# EAGLE design ESPSwitchBoard (EAGLE 7.3.0)
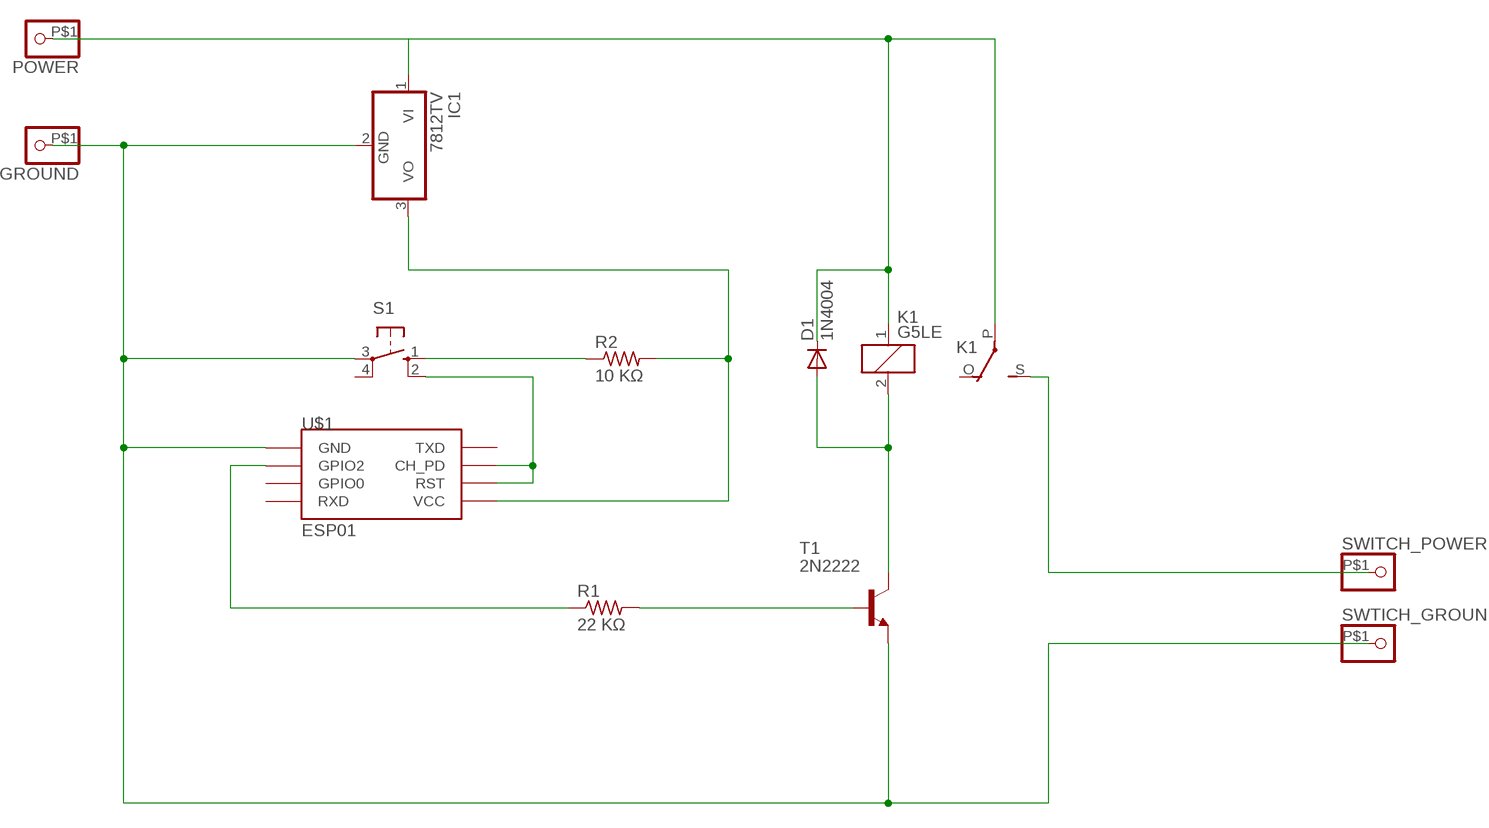
[diagram p0: schematic, sheet 1]

## Parts
D1  1N4004  [DO41-10]
GROUND  PINHD-1X1-BIGPOGO  [1X1-BIGPOGO]
IC1  7812TV  [TO220V]
K1  G5LE  [G5LE]
POWER  PINHD-1X1-BIGPOGO  [1X1-BIGPOGO]
R1  22 KΩ  FLIPFLOP-RES  [0805-THM]
R2  10 KΩ  FLIPFLOP-RES  [0805-THM]
S1  10-XX  [B3F-10XX]
SWITCH_POWER  PINHD-1X1-BIGPOGO  [1X1-BIGPOGO]
SWTICH_GROUND  PINHD-1X1-BIGPOGO  [1X1-BIGPOGO]
T1  2N2222  [TO92-EBC-OVAL]
U$1  ESP01  [ESP01]

## Nets
N$1: D1.C IC1.1(VI) K1.1 K1.P(2:P) POWER.P$1
N$2: GROUND.P$1 IC1.2(GND) S1.3(P) SWTICH_GROUND.P$1 T1.E U$1.GND
N$3: IC1.3(VO) R2.2 U$1.VCC
N$4: K1.S(2:S) SWITCH_POWER.P$1
N$5: D1.A K1.2 T1.C
N$6: R1.2 T1.B
N$7: R1.1 U$1.GPIO2
N$8: R2.1 S1.1(S)
N$9: S1.2(S1) U$1.CH_PD U$1.RST
Unconnected: K1.O(2:O) S1.4(P1) U$1.GPIO0 U$1.RX(RXD) U$1.TX(TXD)

## Library data of the parts
D1 = diode:1N4004: DIODE general purpose rectifier, 1 A
GROUND POWER SWITCH_POWER SWTICH_GROUND = adafruit:PINHD-1X1: Pin header 1x1 for 0.1" spacing With round pins
IC1 = linear:78*: Positive VOLTAGE REGULATOR Source: http://cache.national.com/ds/LM/LM78L05.pdf http://www.fairchildsemi.com/ds/LM/LM7805.pdf
K1 = relay:G5LE: RELAY 1 x switch, 10 A/120 V AC, 8 A/30 V DC, Omron; OC_FARNELL: unknown; OC_NEWARK: unknown
R1 R2 = adafruit:FLIPFLOP-RES: Flip Flop resistor An 0805 resistor inside a standard 1/4W 5% resistor. Makes for easy mods
S1 = switch-omron:10-XX: OMRON SWITCH; MPN: B3F-1000; OC_FARNELL: 176432; OC_NEWARK: 36M3542
T1 = adafruit:2N2222: NPN TRANSISTOR Big oval pads
U$1 = esp8266modules:ESP01: ESP8266 Wifi module 01

## Board
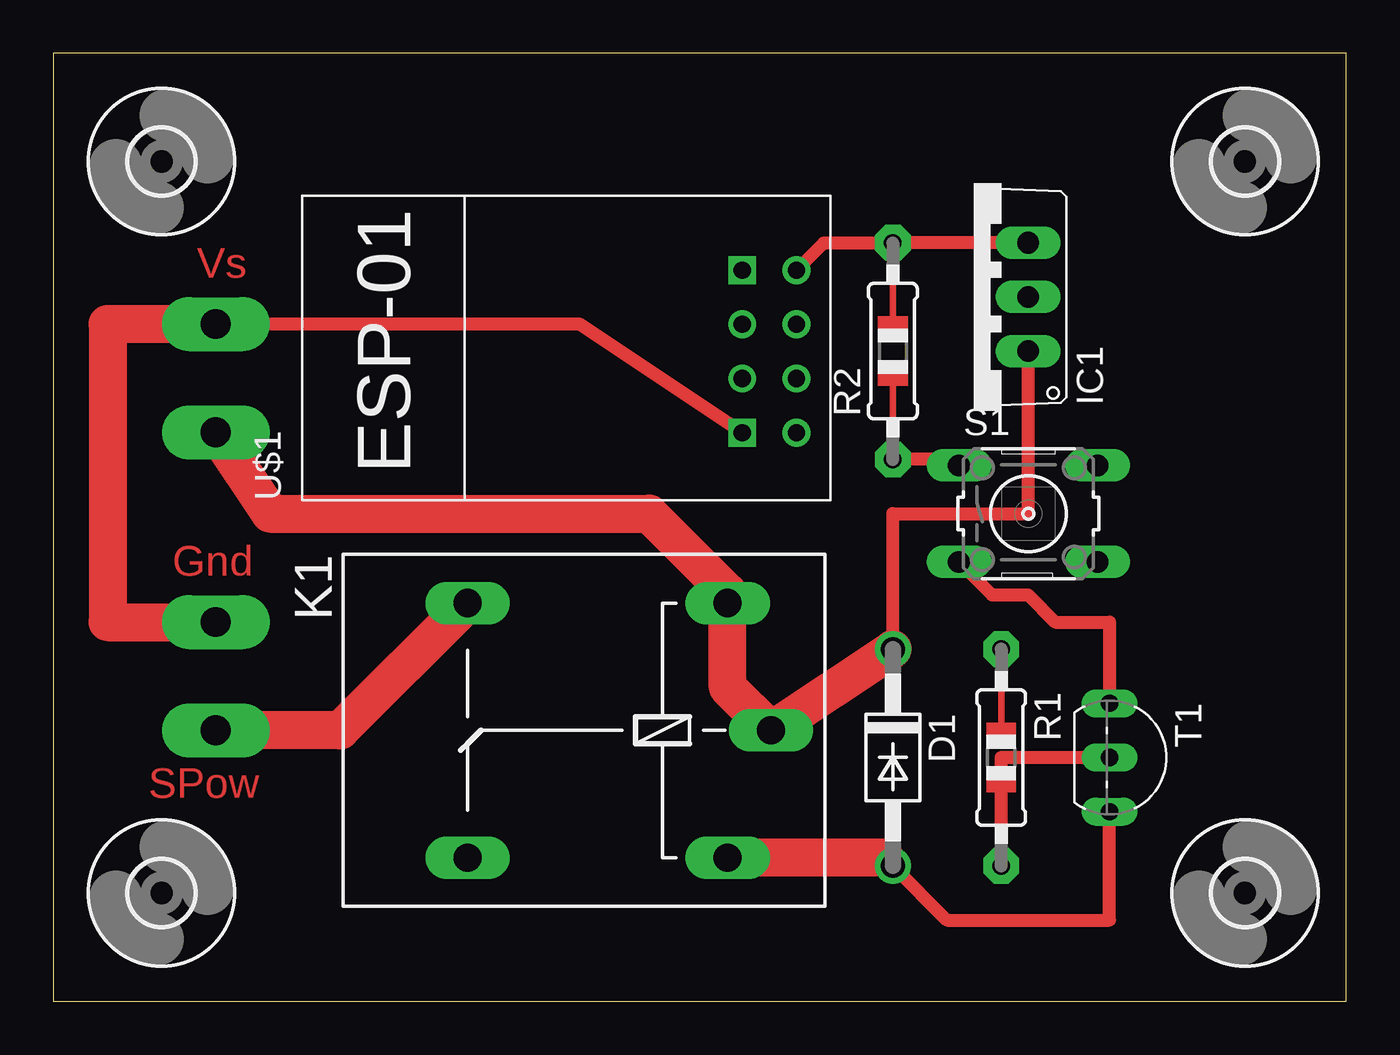
[diagram p1: board, top side]
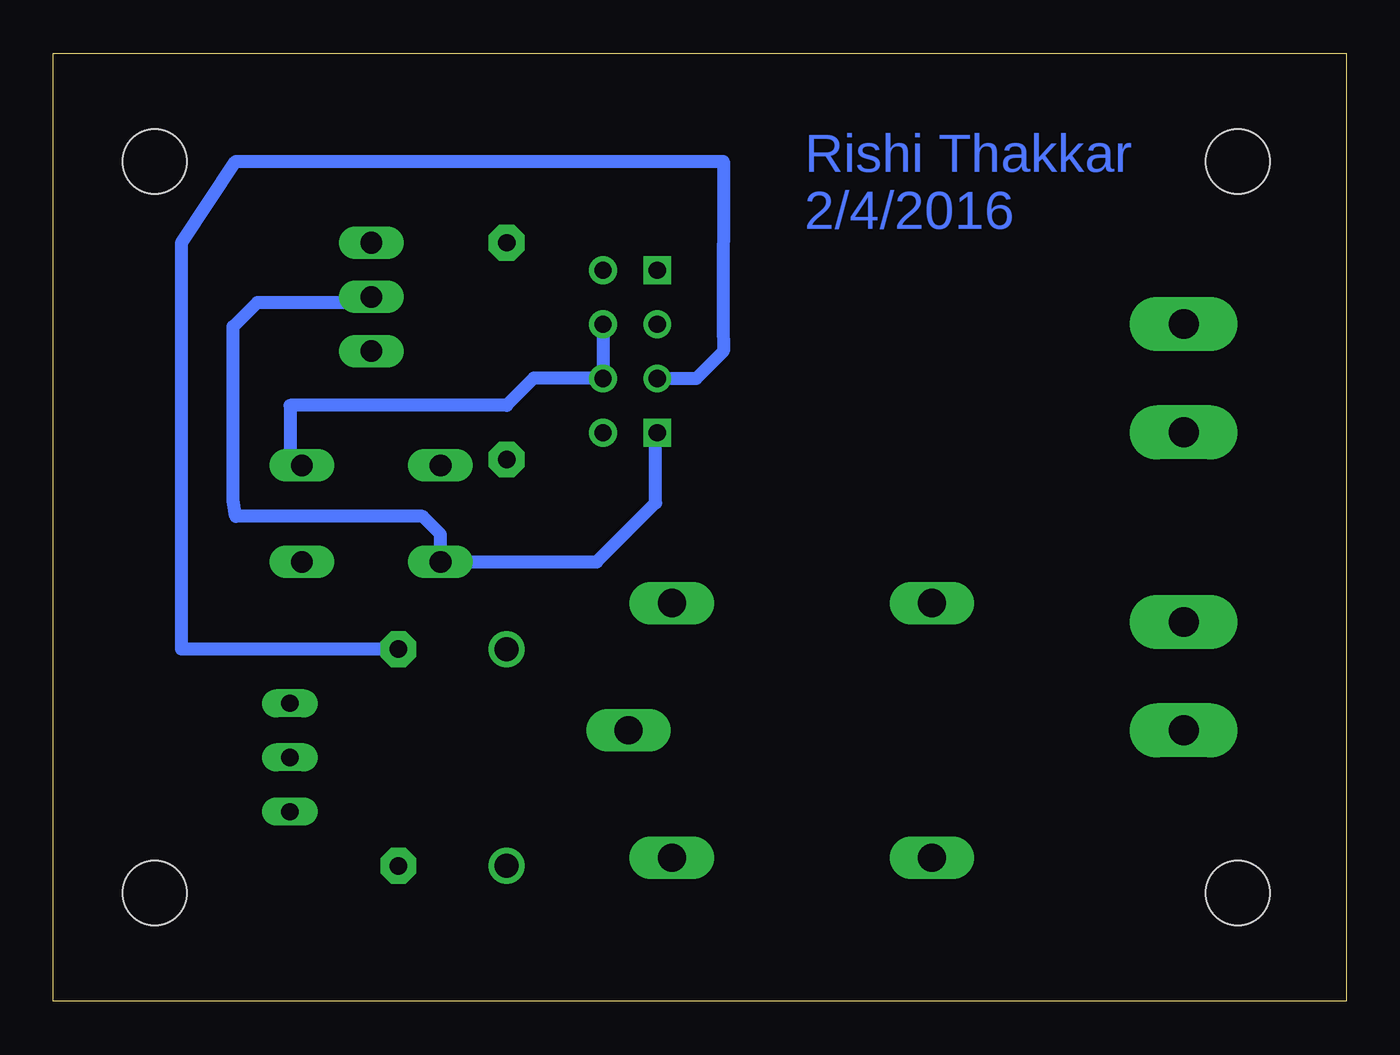
[diagram p2: board, bottom side, seen from below]

Size 60.63 x 44.44 mm. Coordinates in mm from the lower left corner, seen from the top.
Outline: 0,0 60.63,0 60.63,44.44 0,44.44 0,0
Copper layers (1*16): Top 0.035mm / dielectric 1.5mm / Bottom 0.035mm
Design rules "default": minimum track width 10mil, minimum drill 24mil, track to track 8mil, track to pad 8mil, pad to pad 8mil, via to via 8mil, smd to smd 8mil, copper to edge 40mil, drill to drill 8mil, minimum pad ring 10mil, minimum via ring 8mil, stop-mask expansion 4mil, vias tented up to drill 0mil, thermal gap 10mil

### Footprints (pad centres in the part's own frame; a part is rotated, then mirrored left to right if it is on the bottom)
DO41-10 = drill 1.118: A 5.08,0; C -5.08,0
1X1-BIGPOGO = drill 1.4 pad 2.54 long: P$1 0,0
TO220V = drill 1.016 long: 1 -2.54,-2.54; 2 0,-2.54; 3 2.54,-2.54
G5LE = drill 1.321 long: 1 -7.493,-5.969; 2 -7.493,5.969; O 4.699,5.969; P -9.525,0; S 4.699,-5.969
0805-THM = drill 0.813 pad 1.676 octagon: 1 -5.08,0; 2 5.08,0
B3F-10XX = drill 1.016 long: 1 -3.251,2.261; 2 3.251,2.261; 3 -3.251,-2.261; 4 3.251,-2.261
TO92-EBC-OVAL = drill 0.813 long: B 0,-1.27; C 2.54,-1.27; E -2.54,-1.27
ESP01 = drill 0.8: CH_PD -1.285,-8.178; GPIO0 1.255,-5.638; GPIO2 -1.285,-5.638; RST 1.255,-8.178; TX -3.825,-8.178; VCC 3.795,-8.178 | drill 0.8 square: GND -3.825,-5.638; RX 3.795,-5.638
3,0 = hole 3: 0,0

### Placement (x,y rotation side)
D1  39.37,11.43 270 top
GROUND  7.62,31.75 0 top
IC1  43.18,33.02 90 top
K1  24.13,12.7 180 top
POWER  7.62,26.67 0 top
R1  44.45,11.43 270 top
R2  39.37,30.48 90 top
S1  45.72,22.86 0 top
SWITCH_POWER  7.62,12.7 0 top
SWTICH_GROUND  7.62,17.78 0 top
T1  50.8,11.43 270 top
U$1  26.67,30.48 90 top
U$2  [3,0]  5.08,39.37 0 top
U$3  [3,0]  55.88,39.37 0 top
U$4  [3,0]  5.08,5.08 0 top
U$5  [3,0]  55.88,5.08 0 top

### Tracks (layer width: path | path; a pad name or v marks a point on that pad's centre or on a via)
N$1
  Top 0.61: D1.C 39.37,22.86 45.72,22.86 IC1.1
  Top 1.27: 31.62,19.18 K1.1
  Top 1.778: POWER.P$1 10.16,22.86 27.94,22.86 31.62,19.18 | K1.1 31.62,14.73 K1.P D1.C
N$2
  Top 0.61: U$1.GND 24.67,31.75 GROUND.P$1 | S1.3 44.02,19.05 45.72,19.05 46.99,17.78 49.53,17.78 T1.E
  Top 1.778: GROUND.P$1 2.54,31.75 2.54,17.78 SWTICH_GROUND.P$1
  Bottom 0.61: U$1.GND 32.38,26.58 32.38,23.37 35.15,20.6 S1.3 42.47,21.89 43.31,22.73 52.07,22.73 52.2,23.5 52.2,31.62 51.05,32.77 45.97,32.77 IC1.2
N$3
  Top 0.61: U$1.VCC 36.13,35.56 R2.2 IC1.3
N$4
  Top 1.778: K1.S 13.46,12.7 SWITCH_POWER.P$1
N$5
  Top 0.61: 38.99,6.73 D1.A 41.91,3.81 49.53,3.81 T1.C
  Top 1.778: 38.99,6.73 K1.2
N$6
  Top 0.61: R1.2 44.45,11.43 T1.B
N$7
  Bottom 0.61: R1.1 54.61,16.51 54.61,35.56 52.07,39.37 29.21,39.37 29.23,31.75 29.21,30.48 30.48,29.2 U$1.GPIO2
N$8
  Top 0.61: S1.1 42.19,25.4 R2.1
N$9
  Bottom 0.61: U$1.RST U$1.CH_PD | U$1.CH_PD | U$1.CH_PD 38.1,29.21 39.37,27.94 49.53,27.94 49.53,25.12 S1.2

### Text on the board
Top: Vs | Gnd | SPow
Bottom: Rishi Thakkar / 2/4/2016